# Altium schematic sheet UWB-Tag_Sch.SchDoc: UWB Tag
size 254 x 177 mm; Author: Hom; CompanyName: KitSprout; DrawnBy: Hom; Engineer: Hom; Organization: KitSprout; Revision: B; SheetNumber: 1; SheetTotal: 1; Version: 1.0; LibVersion: 2.9; PageSetup: Record=PageOptions|CenterHorizontal=True|CenterVertical=True|PrintScale=1.00|XCorrection=1.00|YCorrection=1.00|PrintKind=0|BorderSize=5000000|LeftOffset=0|BottomOffset=0|Orientation=2|PaperLength=1000|PaperWidth=1000|Scale=100|PaperSource=7|PrintQuality=-3|MediaType=1|DitherType=10|PrintScaleMode=0|PaperKind=A4|PaperIndex=9
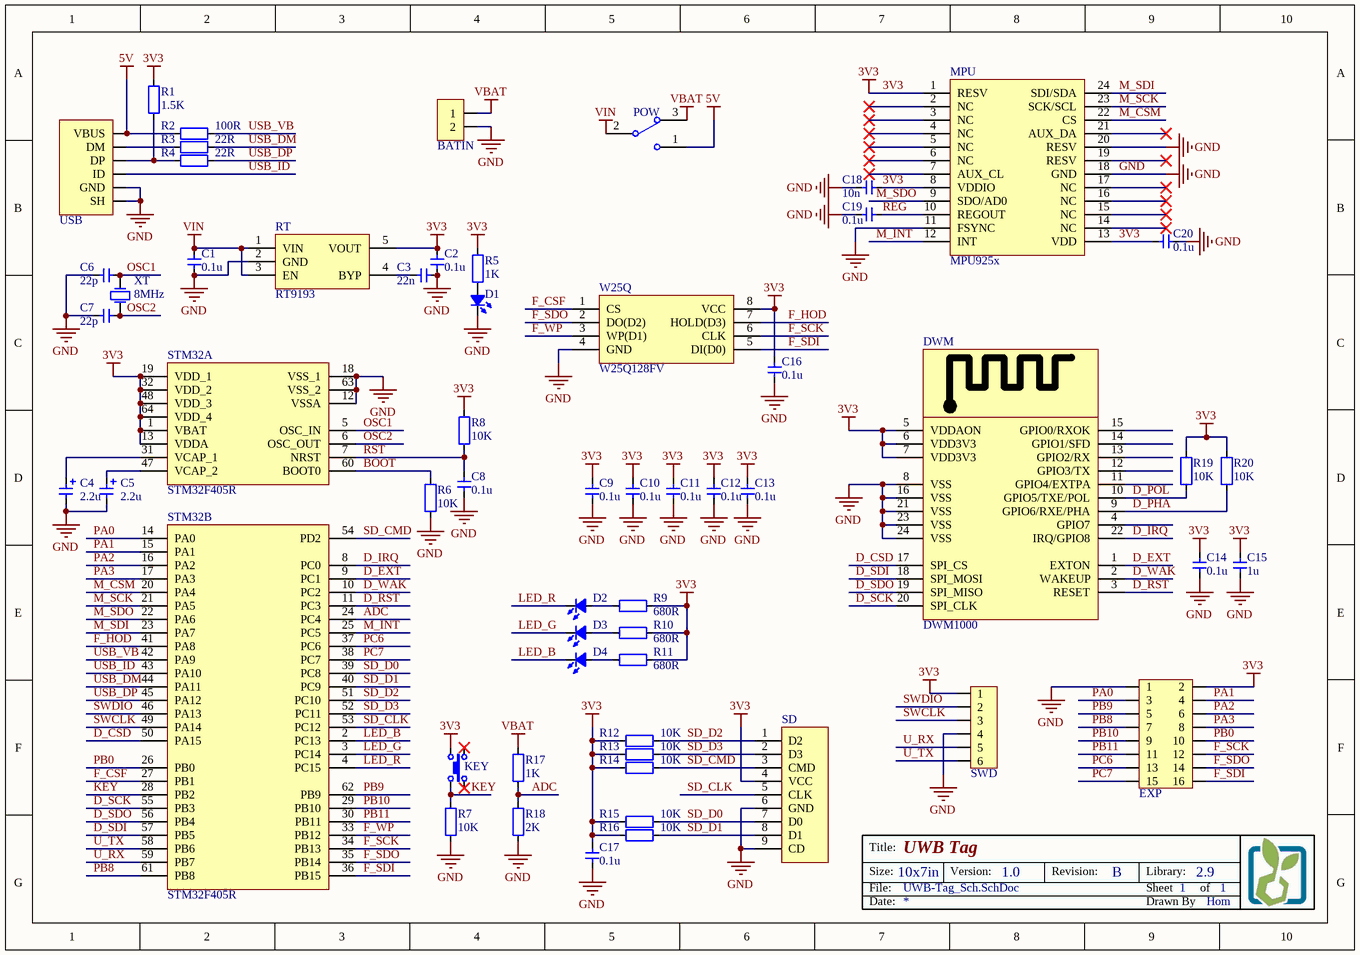
[diagram p0: UWB-Tag_Sch.SchDoc]

## Parts
BATIN  MX1.25_2P  [MX1.25_S90_2P]  (value not drawn)
C1  value 0.1u  [CAP_0603]  (hidden comment: Cap_0603)
C2  value 0.1u  [CAP_0603]  (hidden comment: Cap_0603)
C3  value 22n  [CAP_0603]  (hidden comment: Cap_0603)
C4  value 2.2u  [CAP_TAN_P0805]  (hidden comment: Cap_Tan_0805)
C5  value 2.2u  [CAP_TAN_P0805]  (hidden comment: Cap_Tan_0805)
C6  value 22p  [CAP_0603]  (hidden comment: Cap_0603)
C7  value 22p  [CAP_0603]  (hidden comment: Cap_0603)
C8  value 0.1u  [CAP_0603]  (hidden comment: Cap_0603)
C9  value 0.1u  [CAP_0603]  (hidden comment: Cap_0603)
C10  value 0.1u  [CAP_0603]  (hidden comment: Cap_0603)
C11  value 0.1u  [CAP_0603]  (hidden comment: Cap_0603)
C12  value 0.1u  [CAP_0603]  (hidden comment: Cap_0603)
C13  value 0.1u  [CAP_0603]  (hidden comment: Cap_0603)
C14  value 0.1u  [CAP_0603]  (hidden comment: Cap_0603)
C15  value 1u  [CAP_0603]  (hidden comment: Cap_0603)
C16  value 0.1u  [CAP_0603]  (hidden comment: Cap_0603)
C17  value 0.1u  [CAP_0603]  (hidden comment: Cap_0603)
C18  value 10n  [CAP_0603]  (hidden comment: Cap_0603)
C19  value 0.1u  [CAP_0603]  (hidden comment: Cap_0603)
C20  value 0.1u  [CAP_0603]  (hidden comment: Cap_0603)
D1  LED_0603  [LED_0603_YELLOW]  (value not drawn)
D2  LED_0603  [LED_0603_RED]  (value not drawn)
D3  LED_0603  [LED_0603_GREEN]  (value not drawn)
D4  LED_0603  [LED_0603_BLUE]  (value not drawn)
DWM  DWM1000  [DWM1000]
EXP  HDR2x8_2.54  [HDR2X8_2.54_180]  (value not drawn)
KEY  ButtonTACT  [ButtonTACT_3.5*3.55_90]  (value not drawn)
MPU  MPU925x  [QFN_P0.4_24]
POW  SwitchSPDT_2.8x6.6_90  [SwitchSPDT_2.8X6.6_90]  (value not drawn)
R1  value 1.5K  [RES_0603]  (hidden comment: Res_0603)
R2  value 100R  [RES_0603]  (hidden comment: Res_0603)
R3  value 22R  [RES_0603]  (hidden comment: Res_0603)
R4  value 22R  [RES_0603]  (hidden comment: Res_0603)
R5  value 1K  [RES_0603]  (hidden comment: Res_0603)
R6  value 10K  [RES_0603]  (hidden comment: Res_0603)
R7  value 10K  [RES_0603]  (hidden comment: Res_0603)
R8  value 10K  [RES_0603]  (hidden comment: Res_0603)
R9  value 680R  [RES_0603]  (hidden comment: Res_0603)
R10  value 680R  [RES_0603]  (hidden comment: Res_0603)
R11  value 680R  [RES_0603]  (hidden comment: Res_0603)
R12  value 10K  [RES_0603]  (hidden comment: Res_0603)
R13  value 10K  [RES_0603]  (hidden comment: Res_0603)
R14  value 10K  [RES_0603]  (hidden comment: Res_0603)
R15  value 10K  [RES_0603]  (hidden comment: Res_0603)
R16  value 10K  [RES_0603]  (hidden comment: Res_0603)
R17  value 1K  [RES_0603]  (hidden comment: Res_0603)
R18  value 2K  [RES_0603]  (hidden comment: Res_0603)
R19  value 10K  [RES_0603]  (hidden comment: Res_0603)
R20  value 10K  [RES_0603]  (hidden comment: Res_0603)
RT  RT9193  [SOT23-5]
SD  SD_Card_TF  [SD_Card_TF]  (value not drawn)
STM32  STM32F405R  [LQFP_P0.5_64]  (parts A,B of 2)
SWD  HDR1x6_1.27  [HDR1X6_1.27_180HFD]  (value not drawn)
USB  USB_Micro  [USB_Micro-AB]  (value not drawn)
W25Q  W25Q128FV  [SON_P1.27H_8]
XT  value 8MHz  [XT_5032_2]  (hidden comment: XTAL_5032_2P)

## Nets
3V3: C2.2 C9.1 C10.1 C11.1 C12.1 C13.2 C14.1 C15.1 C16.1 C17.1 C18.2 C20.2 DWM.5(VDDAON) DWM.6(VDD3V3) DWM.7(VDD3V3) EXP.2 KEY.2 MPU.1(RESV) MPU.8(VDDIO) MPU.13(VDD) R1.1 R5.2 R8.2 R9.1 R10.1 R11.1 R12.2 R13.2 R14.2 R15.2 R16.2 R19.2 R20.2 RT.5(VOUT) SD.4(VCC) STM32.1(VBAT) STM32.13(VDDA) STM32.19(VDD_1) STM32.32(VDD_2) STM32.48(VDD_3) STM32.64(VDD_4) SWD.1 W25Q.8(VCC)
5V: POW.1 R2.2 USB.1(VBUS)
GND: BATIN.2 C1.1 C2.1 C3.1 C4.2 C5.2 C6.2 C7.2 C8.1 C9.2 C10.2 C11.2 C12.2 C13.1 C14.2 C15.2 C16.2 C17.2 C18.1 C19.1 C20.1 D1.2(K) DWM.8(VSS) DWM.16(VSS) DWM.21(VSS) DWM.23(VSS) DWM.24(VSS) EXP.1 MPU.11(FSYNC) MPU.18(GND) MPU.20(RESV) R6.1 R7.1 R18.2 RT.2(GND) SD.6(GND) SD.9(CD) STM32.12(VSSA) STM32.18(VSS_1) STM32.63(VSS_2) SWD.4 USB.0(SH) USB.5(GND) W25Q.4(GND)
VBAT: BATIN.1 POW.3 R17.1
VIN: C1.2 POW.2 RT.1(VIN) RT.3(EN)
ADC: R17.2 R18.1 STM32.24(PC4)
BOOT: R6.2 STM32.60(BOOT0)
D_CSD: DWM.17(SPI_CS) STM32.50(PA15)
D_EXT: DWM.1(EXTON) STM32.9(PC1)
D_IRQ: DWM.22(IRQ/GPIO8) STM32.8(PC0)
D_PHA: DWM.9(GPIO6/RXE/PHA) R20.1
D_POL: DWM.10(GPIO5/TXE/POL) R19.1
D_RST: DWM.3(RESET) STM32.11(PC3)
D_SCK: DWM.20(SPI_CLK) STM32.55(PB3)
D_SDI: DWM.18(SPI_MOSI) STM32.57(PB5)
D_SDO: DWM.19(SPI_MISO) STM32.56(PB4)
D_WAK: DWM.2(WAKEUP) STM32.10(PC2)
F_CSF: STM32.27(PB1) W25Q.1(CS)
F_HOD: STM32.41(PA8) W25Q.7(HOLD(D3))
F_SCK: EXP.12 STM32.34(PB13) W25Q.6(CLK)
F_SDI: EXP.16 STM32.36(PB15) W25Q.5(DI(D0))
F_SDO: EXP.14 STM32.35(PB14) W25Q.2(DO(D2))
F_WP: STM32.33(PB12) W25Q.3(WP(D1))
KEY: KEY.1 R7.2 STM32.28(PB2)
LED_B: D4.2(K) STM32.2(PC13)
LED_G: D3.2(K) STM32.3(PC14)
LED_R: D2.2(K) STM32.4(PC15)
M_CSM: MPU.22(CS) STM32.20(PA4)
M_INT: MPU.12(INT) STM32.25(PC5)
M_SCK: MPU.23(SCK/SCL) STM32.21(PA5)
M_SDI: MPU.24(SDI/SDA) STM32.23(PA7)
M_SDO: MPU.9(SDO/AD0) STM32.22(PA6)
OSC1: C6.1 STM32.5(OSC_IN) XT.2(OSC2)
OSC2: C7.1 STM32.6(OSC_OUT) XT.1(OSC1)
PA0: EXP.3 STM32.14(PA0)
PA1: EXP.4 STM32.15(PA1)
PA2: EXP.6 STM32.16(PA2)
PA3: EXP.8 STM32.17(PA3)
PB0: EXP.10 STM32.26(PB0)
PB8: EXP.7 STM32.61(PB8)
PB9: EXP.5 STM32.62(PB9)
PB10: EXP.9 STM32.29(PB10)
PB11: EXP.11 STM32.30(PB11)
PC6: EXP.13 STM32.37(PC6)
PC7: EXP.15 STM32.38(PC7)
REG: C19.2 MPU.10(REGOUT)
RST: C8.2 R8.1 STM32.7(NRST)
SD_CLK: SD.5(CLK) STM32.53(PC12)
SD_CMD: R14.1 SD.3(CMD) STM32.54(PD2)
SD_D0: R15.1 SD.7(D0) STM32.39(PC8)
SD_D1: R16.1 SD.8(D1) STM32.40(PC9)
SD_D2: R12.1 SD.1(D2) STM32.51(PC10)
SD_D3: R13.1 SD.2(D3) STM32.52(PC11)
SWCLK: STM32.49(PA14) SWD.3
SWDIO: STM32.46(PA13) SWD.2
U_RX: STM32.59(PB7) SWD.5
U_TX: STM32.58(PB6) SWD.6
USB_DM: R3.1 STM32.44(PA11)
USB_DP: R4.1 STM32.45(PA12)
USB_ID: STM32.43(PA10) USB.4(ID)
USB_VB: R2.1 STM32.42(PA9)
NetC3_2: C3.2 RT.4(BYP)
NetC4_1: C4.1 STM32.31(VCAP_1)
NetC5_1: C5.1 STM32.47(VCAP_2)
NetD1_1: D1.1(A) R5.1
NetD2_1: D2.1(A) R9.2
NetD3_1: D3.1(A) R10.2
NetD4_1: D4.1(A) R11.2
NetR1_2: R1.2 R4.2 USB.3(DP)
NetR3_2: R3.2 USB.2(DM)

Not connected (* = marked no-connect by the designer): DWM 4(GPIO7) 11(GPIO4/EXTPA) 12(GPIO3/TX) 13(GPIO2/RX) 14(GPIO1/SFD) 15(GPIO0/RXOK); KEY 3* 4*; MPU 2(NC)* 3(NC)* 4(NC)* 5(NC)* 6(NC)* 7(AUX_CL)* 14(NC)* 15(NC)* 16(NC)* 17(NC)* 19(RESV)* 21(AUX_DA)*

## Notes on the sheet
- Title:
- Size:
- Date:
- File:
- 10x7in
- Version:
- Revision:
- Sheet
- Drawn By
- Library:
- of

## Library data of the parts
BATIN = MX1.25_2P: MX
C1-C3 C6-C20 = Cap_0603: Capacitor
C4 C5 = Cap_Tan_0805: Capacitor
D1-D4 = LED_0603: LED
DWM = DWM1000: Module; Manufacturer: Decawave Limited; Frequency: 3.5GHz ~ 6.5GHz; Data Rate: 6.8Mbps; Serial Interfaces: SPI; Antenna Type: Integrated, Chip; Voltage - Supply: 2.8 V ~ 3.6 V; Current - Receiving: 64mA; Current - Transmitting: 31mA; Supplier 1: Digi-Key; Manufacturer Part Number: DWM1000; RoHS: RoHS Compliant; Category: RF/IF and RFID; Stock 1: 1028; Pricing 1: 1=32.16, 10=26.704, 100=24.24, 250=22.51296 (USD); Packaging: Cut Tape (CT); RF Family/Standard: 802.15.4; Protocol: -; Modulation: -; Power - Output: -; Sensitivity: -; Memory Size: -; Mounting Type: Surface Mount; Operating Temperature: -40°C ~ 85°C; Package / Case: Module; ComponentLink1URL: http://www.decawave.com/sites/default/files/product-pdf/dwm1000-product-brief.pdf; ComponentLink1Description: http://www.decawave.com/sites/default/files/product-pdf/dwm1000-product-brief.pdf; Supplier Part Number 1: 1479-1002-1-ND
EXP = HDR2x8_2.54: Header
KEY = ButtonTACT: Button
MPU = MPU925x: Sensor Motion
POW = SwitchSPDT_2.8x6.6_90: Switch
R1-R20 = Res_0603: Resistor
RT = RT9193: Power
SD = SD_Card_TF: SD
STM32 = STM32F405R: MCU
SWD = HDR1x6_1.27: Header
USB = USB_Micro: USB
W25Q = W25Q_8: FLASH
XT = XTAL_5032_2P: Crystal Oscillator